# EAGLE design RotaryEncoder_Breakout_4ch (EAGLE 6.5.0)
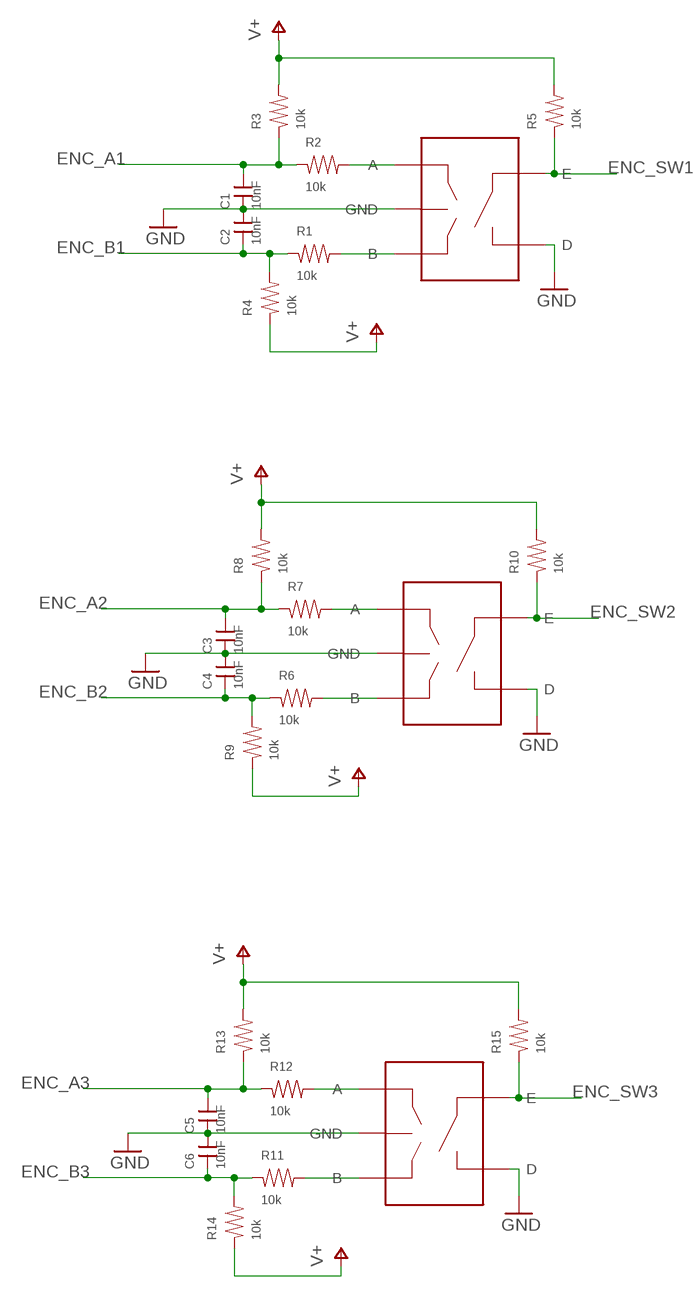
[diagram p0: schematic, sheet 1]

## Parts
C1  10nF  CAP0603  [0603]
C2  10nF  CAP0603  [0603]
C3  10nF  CAP0603  [0603]
C4  10nF  CAP0603  [0603]
C5  10nF  CAP0603  [0603]
C6  10nF  CAP0603  [0603]
ENC1  PEC09  [PEC092320FS]
ENC2  PEC09  [PEC092320FS]
ENC3  PEC09  [PEC092320FS]
R1  10k  RES0603  [0603]
R2  10k  RES0603  [0603]
R3  10k  RES0603  [0603]
R4  10k  RES0603  [0603]
R5  10k  RES0603  [0603]
R6  10k  RES0603  [0603]
R7  10k  RES0603  [0603]
R8  10k  RES0603  [0603]
R9  10k  RES0603  [0603]
R10  10k  RES0603  [0603]
R11  10k  RES0603  [0603]
R12  10k  RES0603  [0603]
R13  10k  RES0603  [0603]
R14  10k  RES0603  [0603]
R15  10k  RES0603  [0603]

## Nets
ENC_A1: C1.2 R2.1 R3.1
ENC_A2: C3.2 R7.1 R8.1
ENC_A3: C5.2 R12.1 R13.1
ENC_B1: C2.1 R1.1 R4.2
ENC_B2: C4.1 R6.1 R9.2
ENC_B3: C6.1 R11.1 R14.2
ENC_SW1: ENC1.E R5.1
ENC_SW2: ENC2.E R10.1
ENC_SW3: ENC3.E R15.1
GND: C1.1 C2.2 C3.1 C4.2 C5.1 C6.2 ENC1.C(GND) ENC1.D ENC2.C(GND) ENC2.D ENC3.C(GND) ENC3.D
N$1: ENC2.B R6.2
N$2: ENC2.A R7.2
N$3: ENC3.B R11.2
N$4: ENC1.B R1.2
N$5: ENC1.A R2.2
N$6: ENC3.A R12.2
V+: R3.2 R4.1 R5.2 R8.2 R9.1 R10.2 R13.2 R14.1 R15.2

## Library data of the parts
C1-C6 = rlc-jqi:CAP: SMT Capacitor
ENC1-ENC3 = connector-jqi:PEC09: PEC09-2320F-S0015 Rotary Encoder (Bourns).
R1-R15 = rlc-jqi:RES: SMT Resistor

## Board
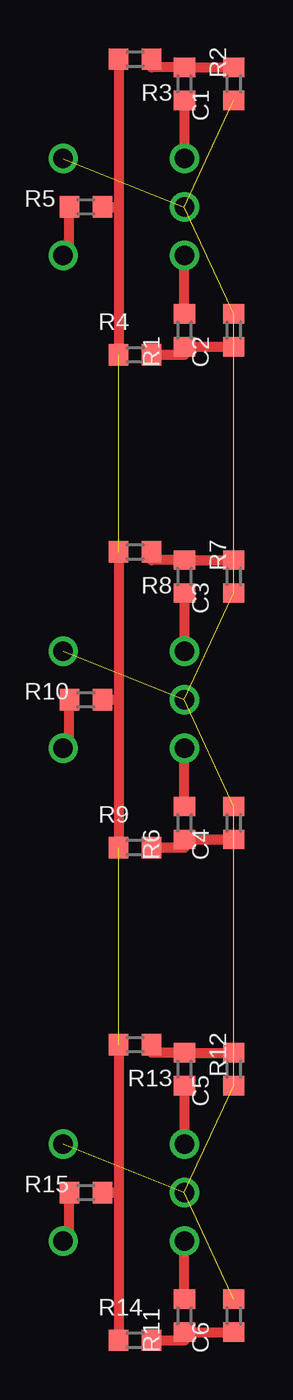
[diagram p1: board, top side]
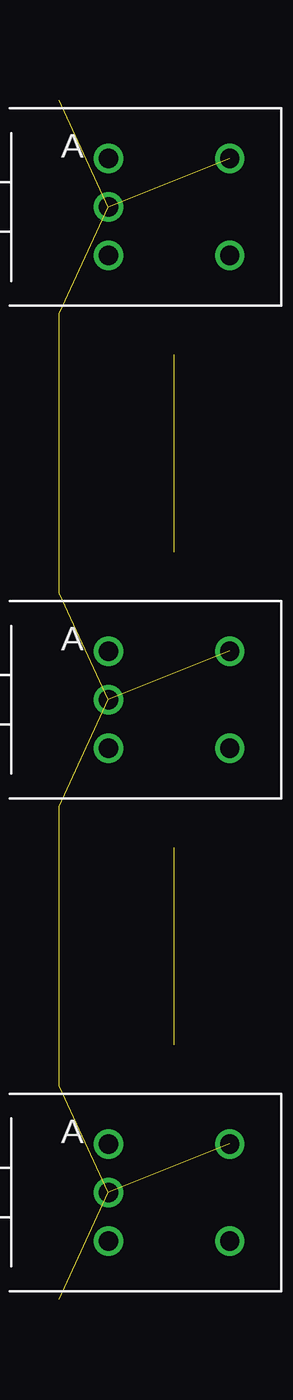
[diagram p2: board, bottom side, seen from below]

No outline drawn. Coordinates in mm, seen from the top.
Copper layers (1*16): Top 0.035mm / dielectric 1.5mm / Bottom 0.035mm
Design rules "default": minimum track width 10mil, minimum drill 24mil, track to track 8mil, track to pad 8mil, pad to pad 8mil, via to via 8mil, smd to smd 8mil, copper to edge 40mil, drill to drill 8mil, minimum pad ring 10mil, minimum via ring 8mil, stop-mask expansion 4mil, vias tented up to drill 0mil, thermal gap 10mil

### Footprints (pad centres in the part's own frame; a part is rotated, then mirrored left to right if it is on the bottom)
0603 = smd 1 x 1.1: 1 -0.85,0; 2 0.85,0
PEC092320FS = drill 1: A 0,-2.5; B 0,2.5; C 0,0; D -6.25,-2.5; E -6.25,2.5

### Placement (x,y rotation side)
C1  2.54,44.45 90 top
C2  2.54,31.75 90 top
C3  2.54,19.05 90 top
C4  2.54,6.35 90 top
C5  2.54,-6.35 90 top
C6  2.54,-19.05 90 top
ENC1  0,38.1 180 bottom
ENC2  0,12.7 180 bottom
ENC3  0,-12.7 180 bottom
R1  0,31.75 90 top
R2  0,44.45 270 top
R3  -2.54,45.72 180 top
R4  -2.54,30.48 0 top
R5  -5.08,38.1 0 top
R6  0,6.35 90 top
R7  0,19.05 270 top
R8  -2.54,20.32 180 top
R9  -2.54,5.08 0 top
R10  -5.08,12.7 0 top
R11  0,-19.05 90 top
R12  0,-6.35 270 top
R13  -2.54,-5.08 180 top
R14  -2.54,-20.32 0 top
R15  -5.08,-12.7 0 top

### Tracks (layer width: path | path; a pad name or v marks a point on that pad's centre or on a via)
ENC_A1
  Top 0.508: C1.2 R2.1 -1.69,45.3 R3.1
ENC_A2
  Top 0.508: C3.2 R7.1 -1.69,19.9 R8.1
ENC_A3
  Top 0.508: C5.2 R12.1 -1.69,-5.5 R13.1
ENC_B1
  Top 0.508: R4.2 0,30.48 R1.1 C2.1
ENC_B2
  Top 0.508: R9.2 0,5.08 R6.1 C4.1
ENC_B3
  Top 0.508: R14.2 0,-20.32 R11.1 C6.1
ENC_SW1
  Top 0.508: ENC1.E -5.93,35.6 R5.1
ENC_SW2
  Top 0.508: ENC2.E -5.93,10.2 R10.1
ENC_SW3
  Top 0.508: ENC3.E -5.93,-15.2 R15.1
GND  (11 unrouted)
N$1
  Top 0.508: R6.2 ENC2.B
N$2
  Top 0.508: R7.2 ENC2.A
N$3
  Top 0.508: R11.2 ENC3.B
N$4
  Top 0.508: R1.2 ENC1.B
N$5
  Top 0.508: R2.2 ENC1.A
N$6
  Top 0.508: R12.2 ENC3.A
V+  (2 unrouted)
  Top 0.508: R5.2 -3.39,38.1 | -3.39,38.1 R4.1 | R3.2 -3.39,38.1 | R10.2 -3.39,12.7 | -3.39,12.7 R9.1 | R8.2 -3.39,12.7 | R15.2 -3.39,-12.7 | -3.39,-12.7 R14.1 | R13.2 -3.39,-12.7